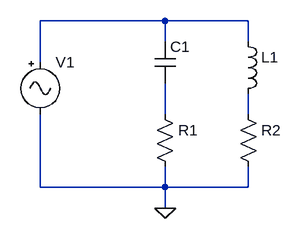
[diagram p0: schematic auxschm.asc]
auxschm.asc, the LTspice schematic file:
Version 4
SHEET 1 880 680
WIRE 96 64 -96 64
WIRE 224 64 96 64
WIRE 96 96 96 64
WIRE 224 96 224 64
WIRE -96 128 -96 64
WIRE 96 208 96 160
WIRE 224 208 224 176
WIRE -96 320 -96 208
WIRE 96 320 96 288
WIRE 96 320 -96 320
WIRE 224 320 224 288
WIRE 224 320 96 320
WIRE 96 352 96 320
FLAG 96 352 0
SYMBOL ind 208 80 R0
SYMATTR InstName L1
SYMATTR Value ""
SYMBOL cap 80 96 R0
SYMATTR InstName C1
SYMATTR Value ""
SYMBOL res 80 192 R0
SYMATTR InstName R1
SYMATTR Value ""
SYMBOL res 208 192 R0
SYMATTR InstName R2
SYMATTR Value ""
SYMBOL Misc\\signal -96 112 R0
WINDOW 3 -126 117 Left 2
WINDOW 123 0 0 Left 2
WINDOW 39 0 0 Left 2
SYMATTR Value ""
SYMATTR InstName V1

The netlist it stands for:
* auxschm.asc
L1 N001 N003
C1 N001 N002
R1 N002 0
R2 N003 0
V1 N001 0
.backanno
.end